# EAGLE design asp32 (EAGLE 6.3)
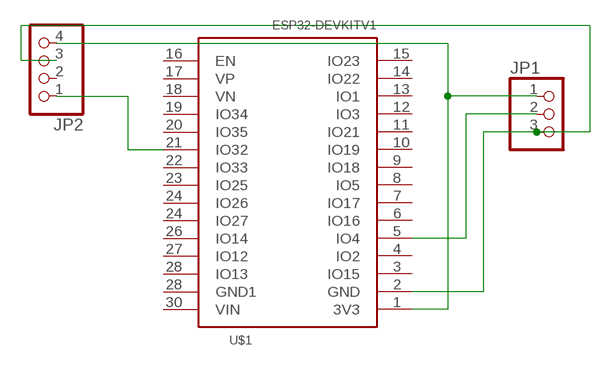
[diagram p0: schematic, sheet 1]

## Parts
JP1  PINHD-1X3  [1X03]
JP2  PINHD-1X4  [1X04]
U$1  ESP32DEVKITV1  [ESP32-DEVKITV1]

## Nets
N$1: JP1.1 JP2.4 U$1.1(3V3)
N$2: JP1.3 JP2.3 U$1.2(GND)
N$3: JP1.2 U$1.5(IO4)
N$5: JP2.1 U$1.21(IO32)
Unconnected: JP2.2 U$1.3(IO15) U$1.4(IO2) U$1.6(IO16) U$1.7(IO17) U$1.8(IO5) U$1.9(IO18) U$1.10(IO19) U$1.11(IO21) U$1.12(IO3) U$1.13(IO1) U$1.14(IO22) U$1.15(IO23) U$1.16(EN) U$1.17(VP) U$1.18(VN) U$1.19(IO34) U$1.20(IO35) U$1.22(IO33) U$1.23(IO25) U$1.24(IO26) U$1.24(IO27) U$1.26(IO14) U$1.27(IO12) U$1.28(GND1) U$1.28(IO13) U$1.30(VIN)

## Library data of the parts
JP1 = pinhead:PINHD-1X3: PIN HEADER
JP2 = pinhead:PINHD-1X4: PIN HEADER
U$1 = ESP32-DEVKITV1:ESP32DEVKITV1

## Board
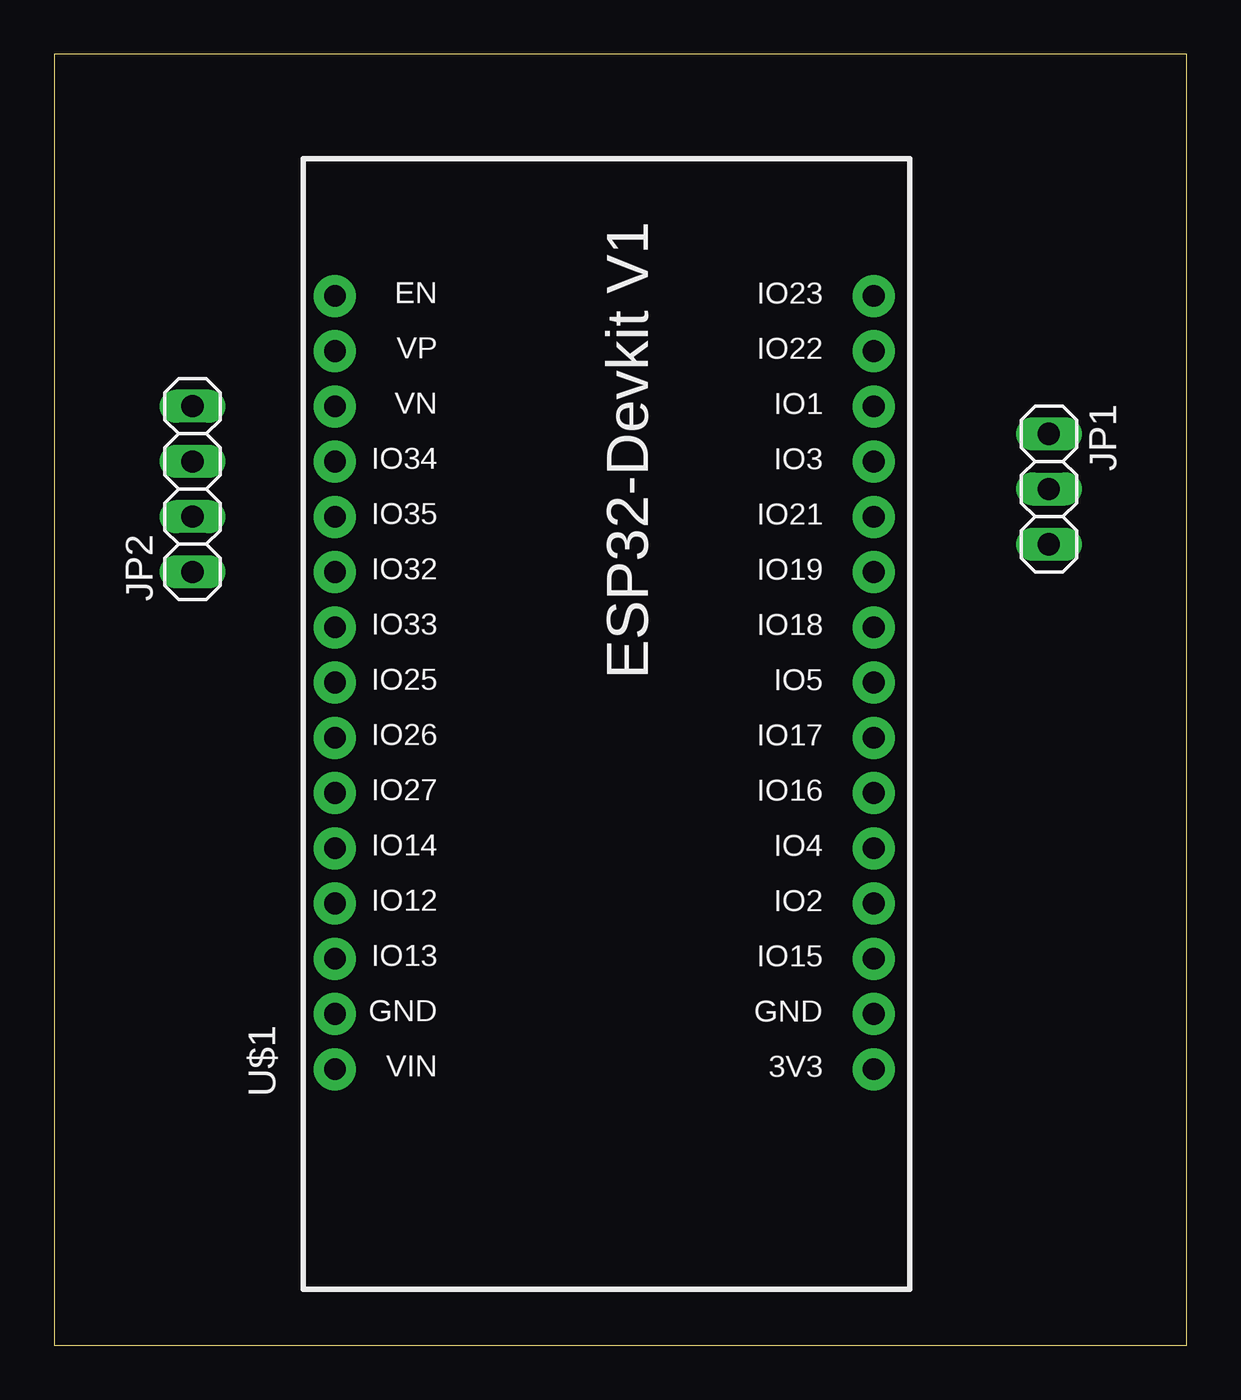
[diagram p1: board, top side]
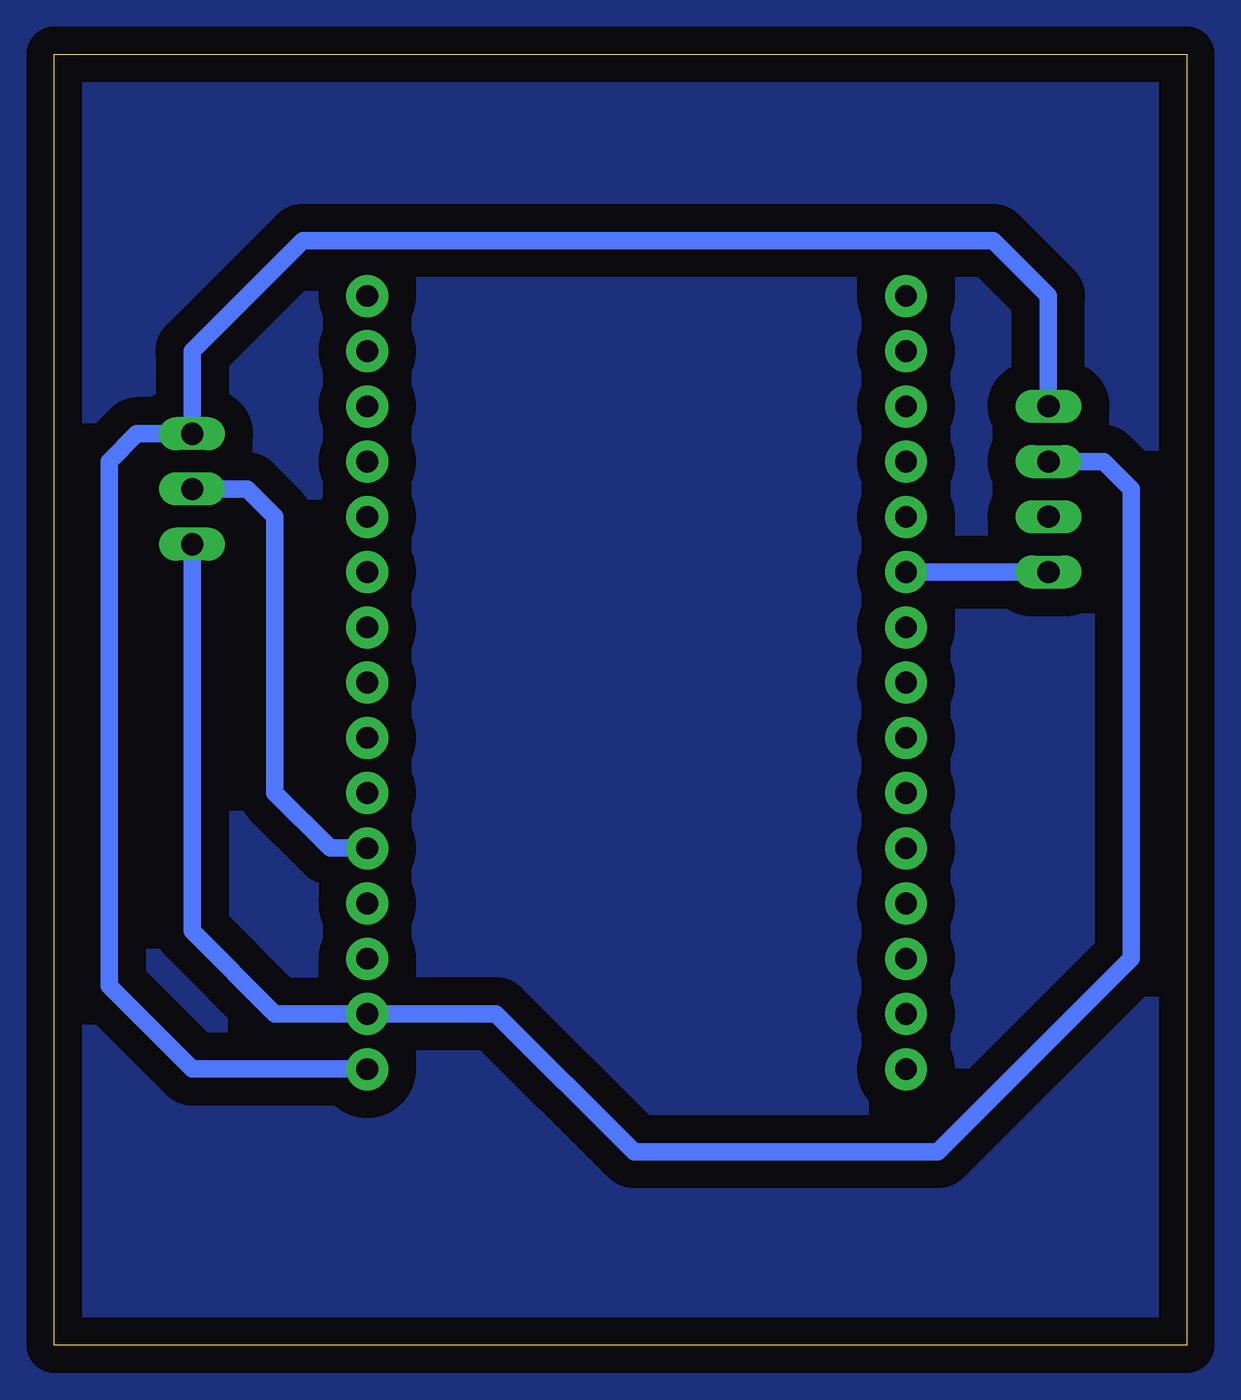
[diagram p2: board, bottom side, seen from below]

Size 52.05 x 59.36 mm. Coordinates in mm from the lower left corner, seen from the top.
Outline: 0,0 52.05,0 52.05,59.36 0,59.36 0,0
Copper layers (1*16): Top 0.035mm / dielectric 1.5mm / Bottom 0.035mm
Design rules "default": minimum track width 10mil, minimum drill 24mil, track to track 8mil, track to pad 8mil, pad to pad 8mil, via to via 8mil, smd to smd 8mil, copper to edge 40mil, drill to drill 8mil, minimum pad ring 10mil, minimum via ring 8mil, stop-mask expansion 4mil, vias tented up to drill 0mil, thermal gap 10mil

### Footprints (pad centres in the part's own frame; a part is rotated, then mirrored left to right if it is on the bottom)
1X03 = drill 1.016 long: 1 -2.54,0; 2 0,0; 3 2.54,0
1X04 = drill 1.016 long: 1 -3.81,0; 2 -1.27,0; 3 1.27,0; 4 3.81,0
ESP32-DEVKITV1 = drill 1 pad 1.93: 1 -22.87,-13.54; 2 -20.33,-13.54; 3 -17.79,-13.54; 4 -15.25,-13.54; 5 -12.71,-13.54; 6 -10.17,-13.54; 7 -7.63,-13.54; 8 -5.09,-13.54; 9 -2.55,-13.54; 10 -0.01,-13.54; 11 2.53,-13.54; 12 5.07,-13.54; 13 7.61,-13.54; 14 10.15,-13.54; 15 12.69,-13.54; 16 12.69,11.23; 17 10.15,11.23; 18 7.61,11.23; 19 5.07,11.23; 20 2.53,11.23; 21 -0.01,11.23; 22 -2.55,11.23; 23 -5.09,11.23; 24 -7.63,11.23; 25 -10.17,11.23; 26 -12.71,11.23; 27 -15.25,11.23; 28 -17.79,11.23; 29 -20.33,11.23; 30 -22.87,11.23

### Placement (x,y rotation side)
JP1  45.72,39.37 270 top
JP2  6.35,39.37 90 top
U$1  24.13,35.56 90 top

### Tracks (layer width: path | path; a pad name or v marks a point on that pad's centre or on a via)
N$1
  Bottom 0.813: JP2.4 6.35,48.26 8.89,50.8 40.64,50.8 45.72,45.72 JP1.1 48.26,41.91 49.53,40.64 49.53,16.51 45.72,12.7 U$1.1
N$2
  Bottom 0.813: JP1.3 45.72,19.05 41.91,15.24 U$1.2 | U$1.2 36.83,15.24 31.75,15.24 25.4,8.89 11.43,8.89 2.54,17.78 2.54,39.37 3.81,40.64 JP2.3 | U$1.2
N$3
  Bottom 0.813: JP1.2 43.18,39.37 41.91,38.1 41.91,25.4 39.37,22.86 U$1.5
N$4
  pour Bottom (isolate 1.27): -2.54,62.23 54.61,62.23 54.61,-2.54 -2.54,-2.54
N$5
  Bottom 0.813: U$1.21 JP2.1